# Altium project Microcontroller_redo.PrjPcb
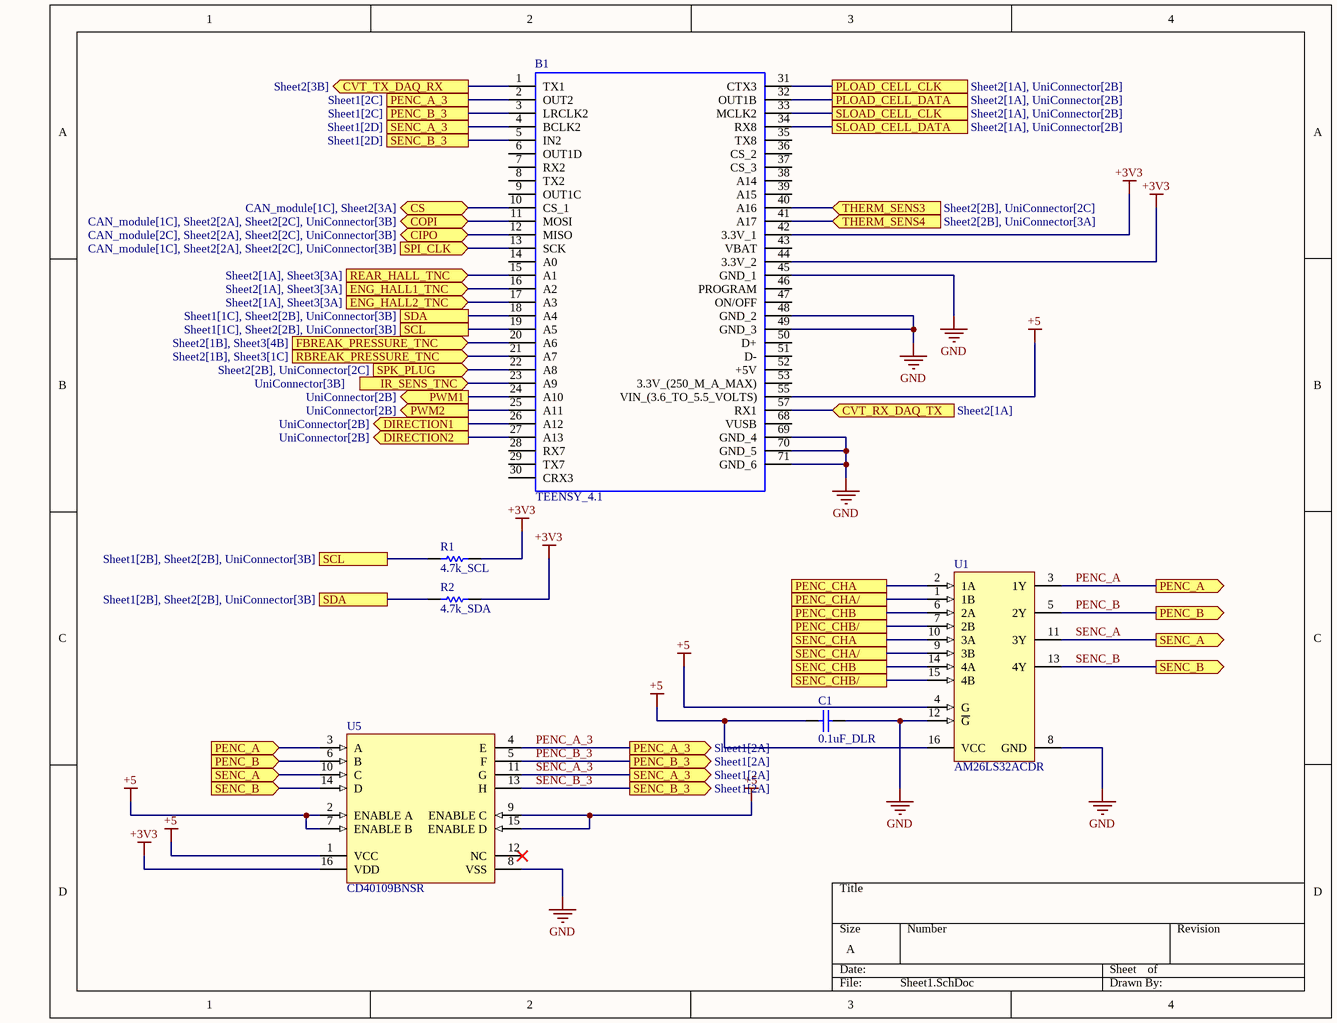
[diagram p0: Sheet1.SchDoc]
5 sheets, 32 parts. Net scope: flat (ports and power ports of the same name join across sheets).
Board file: Microcontroller_Redo.PcbDoc
Sheets:
  Sheet1.SchDoc
  Sheet2.SchDoc
  Sheet3.SchDoc
  UniConnector.SchDoc
  CAN_module.SchDoc

## Sheet Sheet1.SchDoc
size A; SheetNumber: 1; SheetTotal: 5

### Parts
B1  TEENSY_4.1  [TEENSY41]
C1  0.1uF_DLR  [CAPC2013X94X50LL20T25]
R1  4.7k_SCL  [RESC2013X60X40LL20T25]
R2  4.7k_SDA  [RESC2013X60X40LL20T25]
U1  AM26LS32ACDR  [D0016A_M]
U5  CD40109BNSR  [NS0016A_N]

### Ports
CIPO (bidir, see CAN_module[2C], Sheet2[2A], Sheet2[2C], UniConnector[3B]), COPI (bidir, see CAN_module[1C], Sheet2[2A], Sheet2[2C], UniConnector[3B]), CS (bidir, see CAN_module[1C], Sheet2[3A]), CVT_RX_DAQ_TX (in, see Sheet2[1A]), CVT_TX_DAQ_RX (out, see Sheet2[3B]), DIRECTION1 (out, see UniConnector[2B]), DIRECTION2 (out, see UniConnector[2B]), ENG_HALL1_TNC (in, see Sheet2[1A], Sheet3[3A]), ENG_HALL2_TNC (in, see Sheet2[1A], Sheet3[3A]), FBREAK_PRESSURE_TNC (in, see Sheet2[1B], Sheet3[4B]), IR_SENS_TNC (in, see UniConnector[3B]), PENC_A (in, see Sheet1[4C]), PENC_A (out, see Sheet1[1C]), PENC_A_3 (out, see Sheet1[2A]), PENC_A_3 (see Sheet1[2C]), PENC_B (in, see Sheet1[4C]), PENC_B (out, see Sheet1[1C]), PENC_B_3 (out, see Sheet1[2A]), PENC_B_3 (see Sheet1[2C]), PENC_CHA (see UniConnector[2A]), PENC_CHA/ (see UniConnector[2A]), PENC_CHB (see UniConnector[2A]), PENC_CHB/ (see UniConnector[2B]), PLOAD_CELL_CLK (see Sheet2[1A], UniConnector[2B]), PLOAD_CELL_DATA (see Sheet2[1A], UniConnector[2B]), PWM1 (out, see UniConnector[2B]), PWM2 (out, see UniConnector[2B]), RBREAK_PRESSURE_TNC (in, see Sheet2[1B], Sheet3[1C]), REAR_HALL_TNC (in, see Sheet2[1A], Sheet3[3A]), SCL (see Sheet1[1C], Sheet2[2B], UniConnector[3B]), SCL (see Sheet1[2B], Sheet2[2B], UniConnector[3B]), SDA (see Sheet1[1C], Sheet2[2B], UniConnector[3B]), SDA (see Sheet1[2B], Sheet2[2B], UniConnector[3B]), SENC_A (in, see Sheet1[4C]), SENC_A (out, see Sheet1[1D]), SENC_A_3 (out, see Sheet1[2A]), SENC_A_3 (see Sheet1[2D]), SENC_B (in, see Sheet1[4C]), SENC_B (out, see Sheet1[1D]), SENC_B_3 (out, see Sheet1[2A]), SENC_B_3 (see Sheet1[2D]), SENC_CHA (see UniConnector[2B]), SENC_CHA/ (see UniConnector[2B]), SENC_CHB (see UniConnector[2B]), SENC_CHB/ (see UniConnector[2B]), SLOAD_CELL_CLK (see Sheet2[1A], UniConnector[2B]), SLOAD_CELL_DATA (see Sheet2[1A], UniConnector[2B]), SPI_CLK (in, see CAN_module[1C], Sheet2[2A], Sheet2[2C], UniConnector[3B]), SPK_PLUG (in, see Sheet2[2B], UniConnector[2C]), THERM_SENS3 (in, see Sheet2[2B], UniConnector[2C]), THERM_SENS4 (in, see Sheet2[2B], UniConnector[3A])

### Nets
+3V3: B1.42(3.3V_1) B1.44(3.3V_2) R1.2 R2.2 U5.16(VDD)
+5: B1.55(VIN_(3.6_TO_5.5_VOLTS)) C1.1 U1.4(G) U1.16(VCC) U5.1(VCC) U5.2(ENABLE_A) U5.7(ENABLE_B) U5.9(ENABLE_C) U5.15(ENABLE_D)
GND: B1.45(GND_1) B1.48(GND_2) B1.49(GND_3) B1.69(GND_4) B1.70(GND_5) B1.71(GND_6) C1.2 U1.8(GND) U1.12(~{G}) U5.8(VSS)
ENG_HALL1_TNC: B1.16(A2) ; port ENG_HALL1_TNC
ENG_HALL2_TNC: B1.17(A3) ; port ENG_HALL2_TNC
PENC_A: U1.3(1Y) U5.3(A) ; port PENC_A
PENC_A_3: B1.2(OUT2) U5.4(E) ; port PENC_A_3
PENC_B: U1.5(2Y) U5.6(B) ; port PENC_B
PENC_B_3: B1.3(LRCLK2) U5.5(F) ; port PENC_B_3
REAR_HALL_TNC: B1.15(A1) ; port REAR_HALL_TNC
SENC_A: U1.11(3Y) U5.10(C) ; port SENC_A
SENC_A_3: B1.4(BCLK2) U5.11(G) ; port SENC_A_3
SENC_B: U1.13(4Y) U5.14(D) ; port SENC_B
SENC_B_3: B1.5(IN2) U5.13(H) ; port SENC_B_3
NetB1_1: B1.1(TX1) ; port CVT_TX_DAQ_RX
NetB1_10: B1.10(CS_1) ; port CS
NetB1_11: B1.11(MOSI) ; port COPI
NetB1_12: B1.12(MISO) ; port CIPO
NetB1_13: B1.13(SCK) ; port SPI_CLK
NetB1_18: B1.18(A4) R2.1 ; port SDA
NetB1_19: B1.19(A5) R1.1 ; port SCL
NetB1_20: B1.20(A6) ; port FBREAK_PRESSURE_TNC
NetB1_21: B1.21(A7) ; port RBREAK_PRESSURE_TNC
NetB1_22: B1.22(A8) ; port SPK_PLUG
NetB1_23: B1.23(A9) ; port IR_SENS_TNC
NetB1_24: B1.24(A10) ; port PWM1
NetB1_25: B1.25(A11) ; port PWM2
NetB1_26: B1.26(A12) ; port DIRECTION1
NetB1_27: B1.27(A13) ; port DIRECTION2
NetB1_31: B1.31(CTX3) ; port PLOAD_CELL_CLK
NetB1_32: B1.32(OUT1B) ; port PLOAD_CELL_DATA
NetB1_33: B1.33(MCLK2) ; port SLOAD_CELL_CLK
NetB1_34: B1.34(RX8) ; port SLOAD_CELL_DATA
NetB1_40: B1.40(A16) ; port THERM_SENS3
NetB1_41: B1.41(A17) ; port THERM_SENS4
NetB1_57: B1.57(RX1) ; port CVT_RX_DAQ_TX
NetJ1_A1: U1.2(1A) ; port PENC_CHA
NetJ1_A2: U1.1(1B) ; port PENC_CHA/
NetJ1_A3: U1.6(2A) ; port PENC_CHB
NetJ1_A4: U1.7(2B) ; port PENC_CHB/
NetJ1_A5: U1.10(3A) ; port SENC_CHA
NetJ1_A6: U1.9(3B) ; port SENC_CHA/
NetJ1_A7: U1.14(4A) ; port SENC_CHB
NetJ1_A8: U1.15(4B) ; port SENC_CHB/

Not connected (* = marked no-connect by the designer): B1 6(OUT1D) 7(RX2) 8(TX2) 9(OUT1C) 14(A0) 28(RX7) 29(TX7) 30(CRX3) 35(TX8) 36(CS_2) 37(CS_3) 38(A14) 39(A15) 43(VBAT) 46(PROGRAM) 47(ON/OFF) 50(D+) 51(D-) 52(+5V) 53(3.3V_(250_M_A_MAX)) 68(VUSB); U5 12(NC)*

### Library data of the parts
B1 = TEENSY_4.1: Teensy 4.1 Development Board; Manufacturer_Name: PJRC; Manufacturer_Part_Number: TEENSY 4.1; Mouser Part Number: *; Mouser Price/Stock: *; Arrow Part Number: *; Arrow Price/Stock: *; Mouser Testing Part Number: *; Mouser Testing Price/Stock: *; Datasheet Link: https://www.pjrc.com/store/teensy41.html
C1 = CMP-2007-04345-1: Manufacturer: AVX Interconnect / Elco; Part Number: 08055A6R2CAT2A
R1 R2 = CMP-2001-00877-1: Manufacturer: Panasonic; Part Number: ERA6AEB7870V
U1 = CMP-0310-00258-2: Quadruple Differential Line Receiver, 0 TX / 4 RX, 0 to 70 degC, 16-Pin SOIC (D), Green (RoHS & no Sb/Br); Manufacturer: Texas Instruments; Rating: Catalog; ICC(Max)(mA): 70; SubFamily: RS-422; Receivers Per Package: 4; ComponentLink1Description: Datasheet; # of TX/RX: 0 TX / 4 RX; Mounting Technology: Surface Mount; Code_JEDEC: MS-012AC; DatasheetVersion: SLLS115E; ComponentLink2Description: Package Specification; Eco-Plan: Green (RoHS & no Sb/Br); PackageDescription: 16-Pin Plastic Small Outline Integrated Circuit, 9.9 x 3.9 mm, Pitch 1.27 mm Pitch; ComponentLink2URL: http://www.ti.com/litv/pdf/mpds178g; PartNumber: AM26LS32ACDR; PackageReference: D0016A; PackageVersion: revM, Jun-2011; ComponentLink1URL: http://www.ti.com/general/docs/lit/getliterature.tsp?genericPartNumber=AM26LS32AC&fileType=pdf
U5 = CMP-1527-00005-2: CMOS Quad Low-to-High Voltage Level Shifter, 3 to 18 V, -55 to 125 degC, 16-Pin SO (NS16), RoHS, Tape and Reel; Manufacturer: Texas Instruments; Number of Channels: 4; VSS: 3 to 18 V; Propagation Delay: 240 ns Max.; ComponentLink2Description: Datasheet; PackageDescription: 16-Pin Plastic Small Outline Package, Body 10.2 x 5.3 mm, Pitch 1.27 mm; Mounting Technology: Surface Mount; Number of Outputs: 4; ComponentLink3URL: http://www.ti.com/lit/ml/msop002a/msop002a.pdf; Packing: Tape and Reel; RoHS: TRUE; Temperature Range: -55 to 125 degC; PartNumber: CD40109BNSR; PackageVersion: 4040062/C; ComponentLink3Description: Package Specification; DatasheetVersion: SCHS099B; ComponentLink2URL: http://www.ti.com/lit/ds/symlink/cd40109b.pdf; Package Reference: NS0016A; Number of Bits: 4; ComponentLink1Description: Manufacturer URL; ComponentLink1URL: www.ti.com

## Sheet Sheet2.SchDoc
size A; SheetNumber: 2; SheetTotal: 5
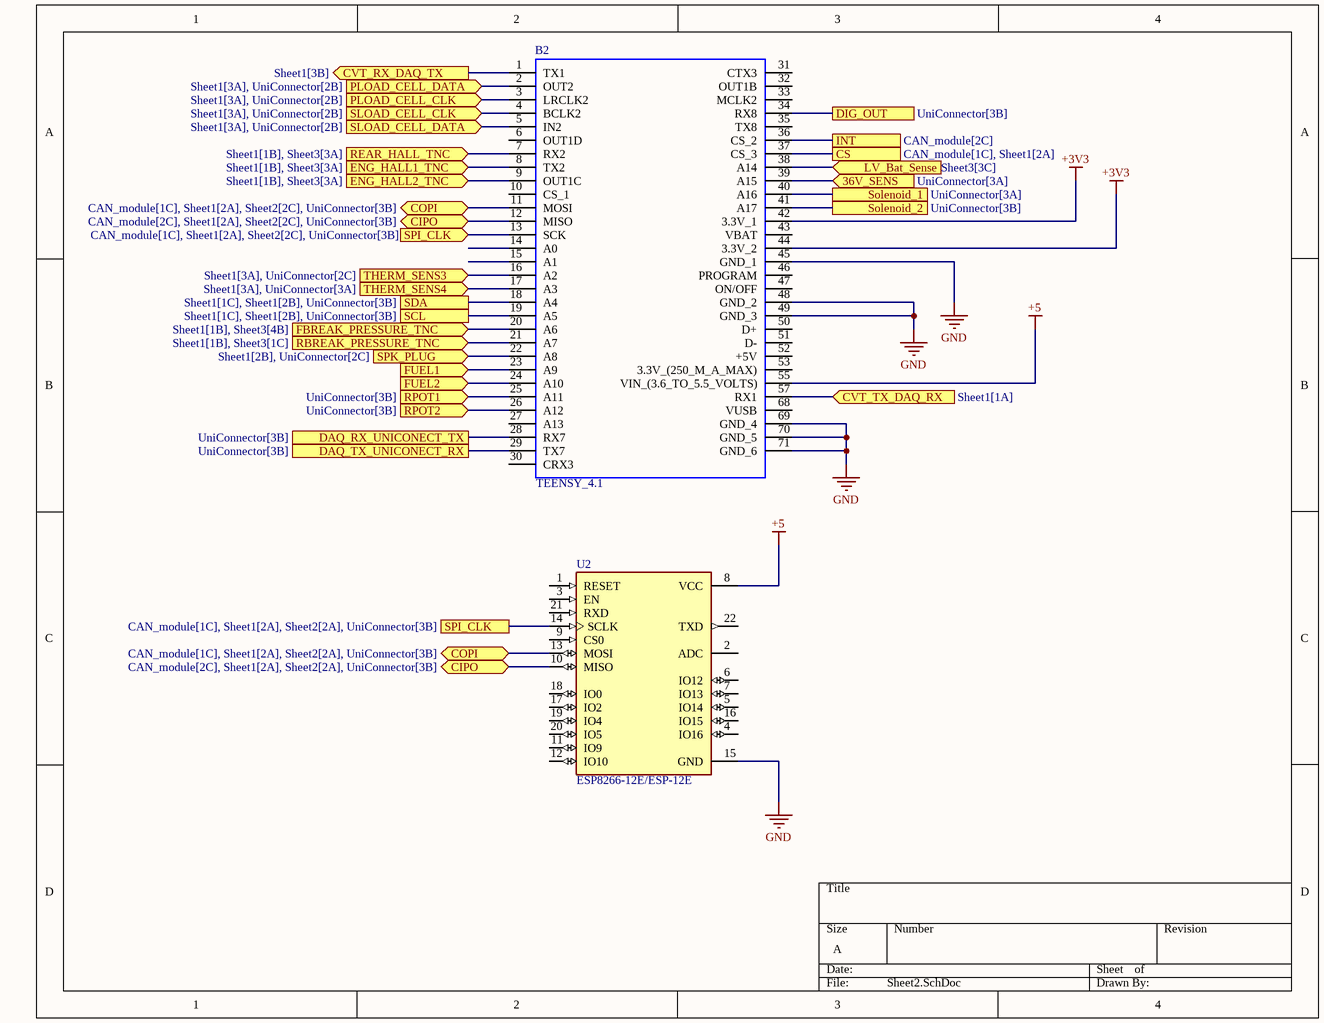
[diagram p1: Sheet2.SchDoc]

### Parts
B2  TEENSY_4.1  [TEENSY41]
U2  ESP8266-12E/ESP-12E  [XCVR_ESP8266-12E/ESP-12E]

### Ports
36V_SENS (in, see UniConnector[3A]), CIPO (bidir, see CAN_module[2C], Sheet1[2A], Sheet2[2A], UniConnector[3B]), CIPO (bidir, see CAN_module[2C], Sheet1[2A], Sheet2[2C], UniConnector[3B]), COPI (bidir, see CAN_module[1C], Sheet1[2A], Sheet2[2A], UniConnector[3B]), COPI (bidir, see CAN_module[1C], Sheet1[2A], Sheet2[2C], UniConnector[3B]), CS (see CAN_module[1C], Sheet1[2A]), CVT_RX_DAQ_TX (out, see Sheet1[3B]), CVT_TX_DAQ_RX (in, see Sheet1[1A]), DAQ_RX_UNICONECT_TX (see UniConnector[3B]), DAQ_TX_UNICONECT_RX (see UniConnector[3B]), DIG_OUT (see UniConnector[3B]), ENG_HALL1_TNC (in, see Sheet1[1B], Sheet3[3A]), ENG_HALL2_TNC (in, see Sheet1[1B], Sheet3[3A]), FBREAK_PRESSURE_TNC (in, see Sheet1[1B], Sheet3[4B]), FUEL1 (in), FUEL2 (in), INT (see CAN_module[2C]), LV_Bat_Sense (in, see Sheet3[3C]), PLOAD_CELL_CLK (in, see Sheet1[3A], UniConnector[2B]), PLOAD_CELL_DATA (in, see Sheet1[3A], UniConnector[2B]), RBREAK_PRESSURE_TNC (in, see Sheet1[1B], Sheet3[1C]), REAR_HALL_TNC (in, see Sheet1[1B], Sheet3[3A]), RPOT1 (in, see UniConnector[3B]), RPOT2 (in, see UniConnector[3B]), SCL (see Sheet1[1C], Sheet1[2B], UniConnector[3B]), SDA (see Sheet1[1C], Sheet1[2B], UniConnector[3B]), SLOAD_CELL_CLK (in, see Sheet1[3A], UniConnector[2B]), SLOAD_CELL_DATA (in, see Sheet1[3A], UniConnector[2B]), Solenoid_1 (see UniConnector[3A]), Solenoid_2 (see UniConnector[3B]), SPI_CLK (in, see CAN_module[1C], Sheet1[2A], Sheet2[2C], UniConnector[3B]), SPI_CLK (see CAN_module[1C], Sheet1[2A], Sheet2[2A], UniConnector[3B]), SPK_PLUG (in, see Sheet1[2B], UniConnector[2C]), THERM_SENS3 (in, see Sheet1[3A], UniConnector[2C]), THERM_SENS4 (in, see Sheet1[3A], UniConnector[3A])

### Nets
+3V3: B2.42(3.3V_1) B2.44(3.3V_2)
+5: B2.55(VIN_(3.6_TO_5.5_VOLTS)) U2.8(VCC)
GND: B2.45(GND_1) B2.48(GND_2) B2.49(GND_3) B2.69(GND_4) B2.70(GND_5) B2.71(GND_6) U2.15(GND)
ENG_HALL1_TNC: B2.8(TX2) ; port ENG_HALL1_TNC
ENG_HALL2_TNC: B2.9(OUT1C) ; port ENG_HALL2_TNC
LV_Bat_Sense: B2.38(A14) ; port LV_Bat_Sense
REAR_HALL_TNC: B2.7(RX2) ; port REAR_HALL_TNC
NetB1_1: B2.57(RX1) ; port CVT_TX_DAQ_RX
NetB1_10: B2.37(CS_3) ; port CS
NetB1_11: B2.11(MOSI) U2.13(MOSI) ; port COPI
NetB1_12: B2.12(MISO) U2.10(MISO) ; port CIPO
NetB1_13: B2.13(SCK) U2.14(SCLK) ; port SPI_CLK
NetB1_18: B2.18(A4) ; port SDA
NetB1_19: B2.19(A5) ; port SCL
NetB1_20: B2.20(A6) ; port FBREAK_PRESSURE_TNC
NetB1_21: B2.21(A7) ; port RBREAK_PRESSURE_TNC
NetB1_22: B2.22(A8) ; port SPK_PLUG
NetB1_31: B2.3(LRCLK2) ; port PLOAD_CELL_CLK
NetB1_32: B2.2(OUT2) ; port PLOAD_CELL_DATA
NetB1_33: B2.4(BCLK2) ; port SLOAD_CELL_CLK
NetB1_34: B2.5(IN2) ; port SLOAD_CELL_DATA
NetB1_40: B2.16(A2) ; port THERM_SENS3
NetB1_41: B2.17(A3) ; port THERM_SENS4
NetB1_57: B2.1(TX1) ; port CVT_RX_DAQ_TX
NetB2_23: B2.23(A9) ; port FUEL1
NetB2_24: B2.24(A10) ; port FUEL2
NetB2_25: B2.25(A11) ; port RPOT1
NetB2_26: B2.26(A12) ; port RPOT2
NetB2_28: B2.28(RX7) ; port DAQ_RX_UNICONECT_TX
NetB2_29: B2.29(TX7) ; port DAQ_TX_UNICONECT_RX
NetB2_34: B2.34(RX8) ; port DIG_OUT
NetB2_36: B2.36(CS_2) ; port INT
NetB2_39: B2.39(A15) ; port 36V_SENS
NetB2_40: B2.40(A16) ; port Solenoid_1
NetB2_41: B2.41(A17) ; port Solenoid_2

Not connected (* = marked no-connect by the designer): B2 6(OUT1D) 10(CS_1) 14(A0) 15(A1) 27(A13) 30(CRX3) 31(CTX3) 32(OUT1B) 33(MCLK2) 35(TX8) 43(VBAT) 46(PROGRAM) 47(ON/OFF) 50(D+) 51(D-) 52(+5V) 53(3.3V_(250_M_A_MAX)) 68(VUSB); U2 1(RESET) 2(ADC) 3(EN) 4(IO16) 5(IO14) 6(IO12) 7(IO13) 9(CS0) 11(IO9) 12(IO10) 16(IO15) 17(IO2) 18(IO0) 19(IO4) 20(IO5) 21(RXD) 22(TXD)

### Library data of the parts
B2 = TEENSY_4.1: as B1 on sheet Sheet1; Manufacturer_Part_Number: TEENSY 4.1; Mouser Part Number: *; Mouser Price/Stock: *; Arrow Part Number: *; Arrow Price/Stock: *; Mouser Testing Part Number: *; Mouser Testing Price/Stock: *; Datasheet Link: https://www.pjrc.com/store/teensy41.html
U2 = ESP8266-12E/ESP-12E: This WiFi module has a 32-bit MCU micro and clock speeds supporting 80 MHz or 160 MHz. Supports the RTOS and integrated Wi-Fi MAC/BB/RF/PA/LNA, and has an on-board antenna.; MF: AI-Thinker; Value: *; SnapEDA_Link: https://www.snapeda.com/parts/ESP8266-12E/ESP-12E/AI-Thinker/view-part/?ref=snap; Availability: Not in stock; Price: None; Package: None; Check_prices: https://www.snapeda.com/parts/ESP8266-12E/ESP-12E/AI-Thinker/view-part/?ref=eda; MP: ESP8266-12E/ESP-12E

## Sheet Sheet3.SchDoc
size A; SheetNumber: 3; SheetTotal: 5
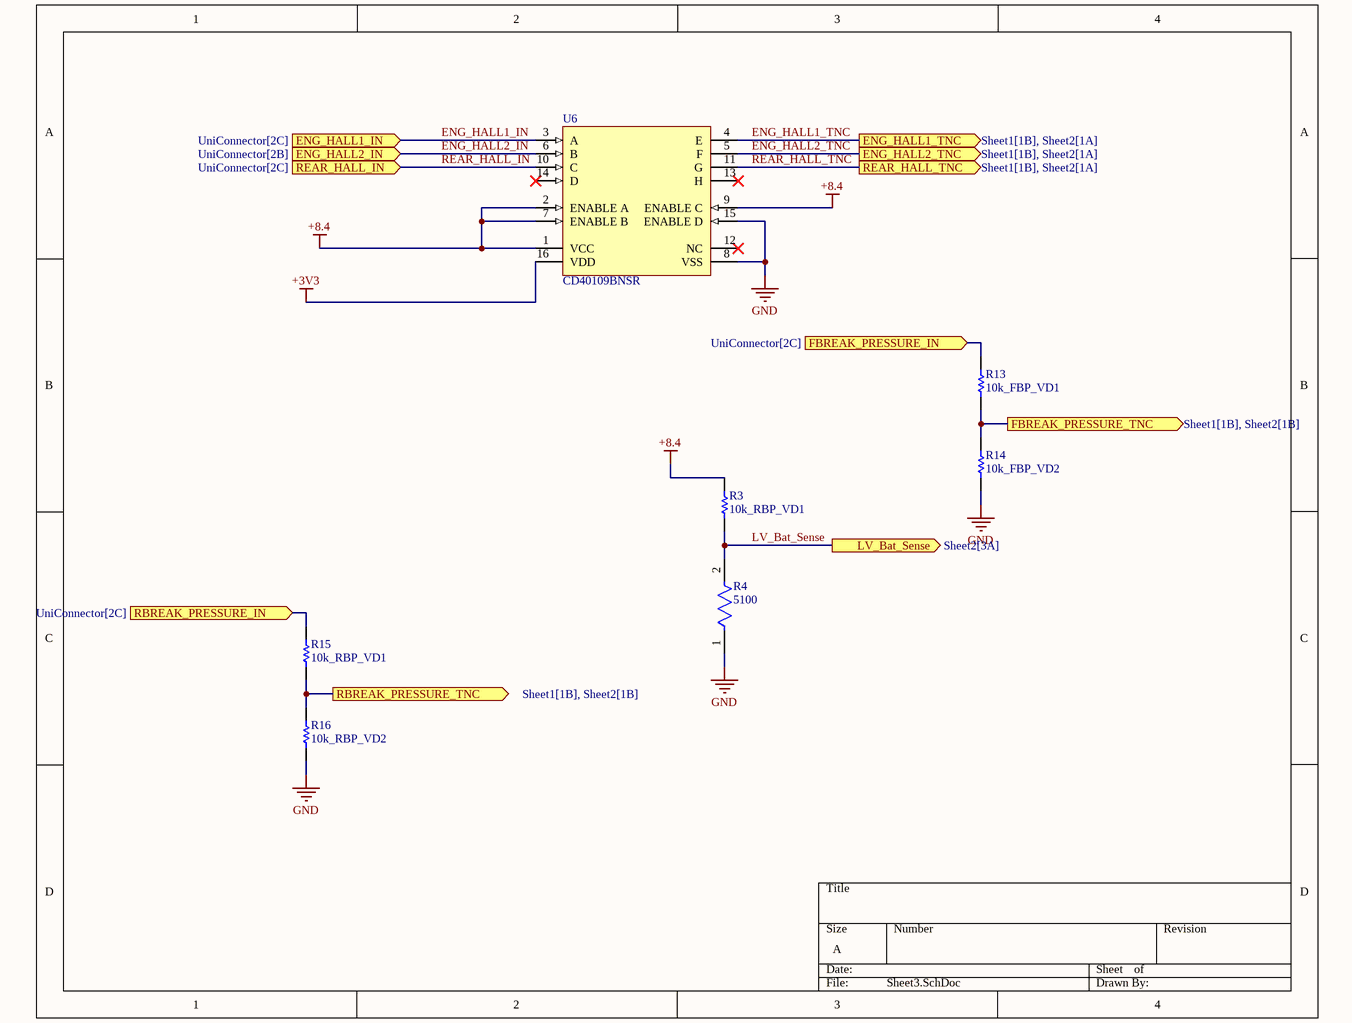
[diagram p2: Sheet3.SchDoc]

### Parts
R3  10k_RBP_VD1  [RESC2013X60X40LL20T25]
R4  5100  [FP-CRCW0805-e3-MFG]
R13  10k_FBP_VD1  [RESC2013X60X40LL20T25]
R14  10k_FBP_VD2  [RESC2013X60X40LL20T25]
R15  10k_RBP_VD1  [RESC2013X60X40LL20T25]
R16  10k_RBP_VD2  [RESC2013X60X40LL20T25]
U6  CD40109BNSR  [NS0016A_N]

### Ports
ENG_HALL1_IN (in, see UniConnector[2C]), ENG_HALL1_TNC (out, see Sheet1[1B], Sheet2[1A]), ENG_HALL2_IN (in, see UniConnector[2B]), ENG_HALL2_TNC (out, see Sheet1[1B], Sheet2[1A]), FBREAK_PRESSURE_IN (in, see UniConnector[2C]), FBREAK_PRESSURE_TNC (out, see Sheet1[1B], Sheet2[1B]), LV_Bat_Sense (out, see Sheet2[3A]), RBREAK_PRESSURE_IN (in, see UniConnector[2C]), RBREAK_PRESSURE_TNC (out, see Sheet1[1B], Sheet2[1B]), REAR_HALL_IN (in, see UniConnector[2C]), REAR_HALL_TNC (out, see Sheet1[1B], Sheet2[1A])

### Nets
+3V3: U6.16(VDD)
+8.4: R3.2 U6.1(VCC) U6.2(ENABLE_A) U6.7(ENABLE_B) U6.9(ENABLE_C)
GND: R4.1 R14.1 R16.1 U6.8(VSS) U6.15(ENABLE_D)
ENG_HALL1_IN: U6.3(A) ; port ENG_HALL1_IN
ENG_HALL1_TNC: U6.4(E) ; port ENG_HALL1_TNC
ENG_HALL2_IN: U6.6(B) ; port ENG_HALL2_IN
ENG_HALL2_TNC: U6.5(F) ; port ENG_HALL2_TNC
LV_Bat_Sense: R3.1 R4.2 ; port LV_Bat_Sense
REAR_HALL_IN: U6.10(C) ; port REAR_HALL_IN
REAR_HALL_TNC: U6.11(G) ; port REAR_HALL_TNC
NetB1_20: R13.1 R14.2 ; port FBREAK_PRESSURE_TNC
NetB1_21: R15.1 R16.2 ; port RBREAK_PRESSURE_TNC
NetJ1_B11: R13.2 ; port FBREAK_PRESSURE_IN
NetJ1_B12: R15.2 ; port RBREAK_PRESSURE_IN

Not connected (* = marked no-connect by the designer): U6 12(NC)* 13(H)* 14(D)*

### Library data of the parts
R3 R13-R16 = CMP-2001-00877-1: as R1 on sheet Sheet1
R4 = CMP-2001-04024-2: RES Thick Film, 5.1kΩ, 1%, 0.125W, 100ppm/°C, 0805 CRCW08055K10FKEA; Power Rating: 125mW; Voltage Rating (DC): 150V; Resistance: 5.1kR; Packaging: Tape and Reel; Case Code (Metric): 2012; Contact Plating: Tin; Case Code (Imperial): 0805; Depth: 1.25mm; Tolerance: 1%; Width: 0.049inch; Temperature Coefficient: 100ppm/°C; Max Power Dissipation: 125mW; Military Standard: Not; Lead Free: Lead Free; Mount: Surface Mount; Min Operating Temperature: -55°C; Package Quantity: 10; Weight: 0.000194oz; Height: 0.45mm; Number of Terminations: 2; Max Operating Temperature: 155°C; Termination: SMD/SMT; Case/Package: 0805; Composition: Thick Film; Voltage Rating: 150V; Length: 2mm; Features: Automotive AEC-Q200; Radiation Hardening: No
U6 = CMP-1527-00005-2: as U5 on sheet Sheet1; ComponentLink2Description: Datasheet; PackageDescription: 16-Pin Plastic Small Outline Package, Body 10.2 x 5.3 mm, Pitch 1.27 mm; Mounting Technology: Surface Mount; Number of Outputs: 4; ComponentLink3URL: http://www.ti.com/lit/ml/msop002a/msop002a.pdf; Packing: Tape and Reel; RoHS: TRUE; Temperature Range: -55 to 125 degC; PartNumber: CD40109BNSR; PackageVersion: 4040062/C; ComponentLink3Description: Package Specification; DatasheetVersion: SCHS099B; ComponentLink2URL: http://www.ti.com/lit/ds/symlink/cd40109b.pdf; Package Reference: NS0016A; Number of Bits: 4; ComponentLink1Description: Manufacturer URL; ComponentLink1URL: www.ti.com

## Sheet UniConnector.SchDoc
size A; SheetNumber: 4; SheetTotal: 5
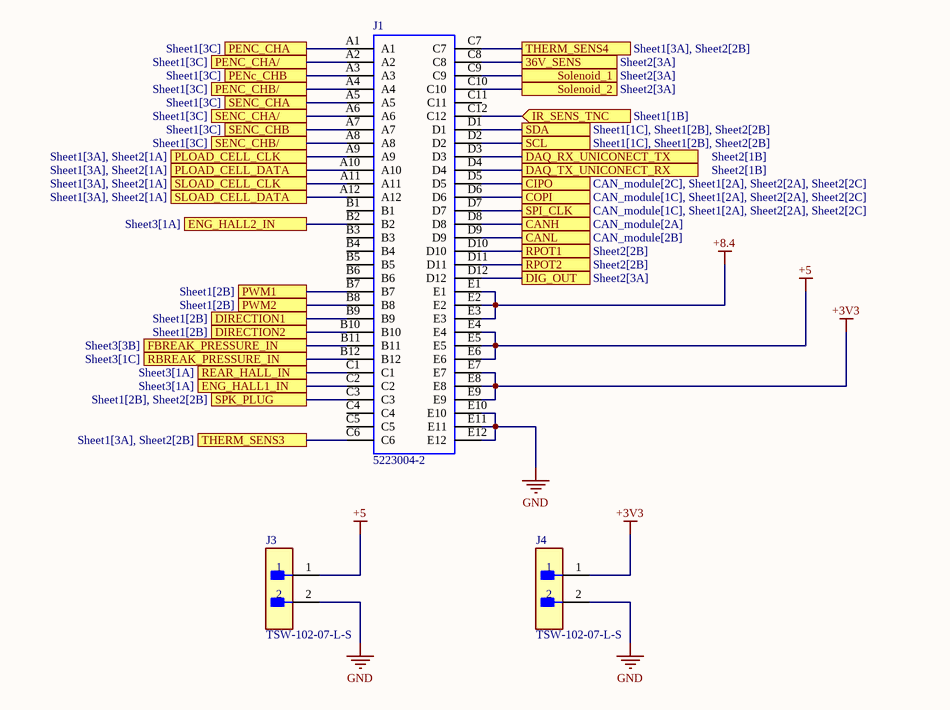
[diagram p3: UniConnector.SchDoc]

### Parts
J1  5223004-2  [52230042]
J3  TSW-102-07-L-S  [FP-TSW-102-07-L-S-MFG]
J4  TSW-102-07-L-S  [FP-TSW-102-07-L-S-MFG]

### Ports
36V_SENS (see Sheet2[3A]), CANH (see CAN_module[2A]), CANL (see CAN_module[2B]), CIPO (see CAN_module[2C], Sheet1[2A], Sheet2[2A], Sheet2[2C]), COPI (see CAN_module[1C], Sheet1[2A], Sheet2[2A], Sheet2[2C]), DAQ_RX_UNICONECT_TX (see Sheet2[1B]), DAQ_TX_UNICONECT_RX (see Sheet2[1B]), DIG_OUT (see Sheet2[3A]), DIRECTION1 (see Sheet1[2B]), DIRECTION2 (see Sheet1[2B]), ENG_HALL1_IN (see Sheet3[1A]), ENG_HALL2_IN (see Sheet3[1A]), FBREAK_PRESSURE_IN (see Sheet3[3B]), IR_SENS_TNC (in, see Sheet1[1B]), PENC_CHA (see Sheet1[3C]), PENC_CHA/ (see Sheet1[3C]), PENc_CHB (see Sheet1[3C]), PENC_CHB/ (see Sheet1[3C]), PLOAD_CELL_CLK (see Sheet1[3A], Sheet2[1A]), PLOAD_CELL_DATA (see Sheet1[3A], Sheet2[1A]), PWM1 (see Sheet1[2B]), PWM2 (see Sheet1[2B]), RBREAK_PRESSURE_IN (see Sheet3[1C]), REAR_HALL_IN (see Sheet3[1A]), RPOT1 (see Sheet2[2B]), RPOT2 (see Sheet2[2B]), SCL (see Sheet1[1C], Sheet1[2B], Sheet2[2B]), SDA (see Sheet1[1C], Sheet1[2B], Sheet2[2B]), SENC_CHA (see Sheet1[3C]), SENC_CHA/ (see Sheet1[3C]), SENC_CHB (see Sheet1[3C]), SENC_CHB/ (see Sheet1[3C]), SLOAD_CELL_CLK (see Sheet1[3A], Sheet2[1A]), SLOAD_CELL_DATA (see Sheet1[3A], Sheet2[1A]), Solenoid_1 (see Sheet2[3A]), Solenoid_2 (see Sheet2[3A]), SPI_CLK (see CAN_module[1C], Sheet1[2A], Sheet2[2A], Sheet2[2C]), SPK_PLUG (see Sheet1[2B], Sheet2[2B]), THERM_SENS3 (see Sheet1[3A], Sheet2[2B]), THERM_SENS4 (see Sheet1[3A], Sheet2[2B])

### Nets
+3V3: J1.E7 J1.E8 J1.E9 J4.1
+5: J1.E4 J1.E5 J1.E6 J3.1
+8.4: J1.E1 J1.E2 J1.E3
GND: J1.E10 J1.E11 J1.E12 J3.2 J4.2
ENG_HALL1_IN: J1.C2 ; port ENG_HALL1_IN
ENG_HALL2_IN: J1.B2 ; port ENG_HALL2_IN
REAR_HALL_IN: J1.C1 ; port REAR_HALL_IN
NetB1_11: J1.D6 ; port COPI
NetB1_12: J1.D5 ; port CIPO
NetB1_13: J1.D7 ; port SPI_CLK
NetB1_18: J1.D1 ; port SDA
NetB1_19: J1.D2 ; port SCL
NetB1_22: J1.C3 ; port SPK_PLUG
NetB1_23: J1.C12 ; port IR_SENS_TNC
NetB1_24: J1.B7 ; port PWM1
NetB1_25: J1.B8 ; port PWM2
NetB1_26: J1.B9 ; port DIRECTION1
NetB1_27: J1.B10 ; port DIRECTION2
NetB1_31: J1.A9 ; port PLOAD_CELL_CLK
NetB1_32: J1.A10 ; port PLOAD_CELL_DATA
NetB1_33: J1.A11 ; port SLOAD_CELL_CLK
NetB1_34: J1.A12 ; port SLOAD_CELL_DATA
NetB1_40: J1.C6 ; port THERM_SENS3
NetB1_41: J1.C7 ; port THERM_SENS4
NetB2_25: J1.D10 ; port RPOT1
NetB2_26: J1.D11 ; port RPOT2
NetB2_28: J1.D3 ; port DAQ_RX_UNICONECT_TX
NetB2_29: J1.D4 ; port DAQ_TX_UNICONECT_RX
NetB2_34: J1.D12 ; port DIG_OUT
NetB2_39: J1.C8 ; port 36V_SENS
NetB2_40: J1.C9 ; port Solenoid_1
NetB2_41: J1.C10 ; port Solenoid_2
NetJ1_A1: J1.A1 ; port PENC_CHA
NetJ1_A2: J1.A2 ; port PENC_CHA/
NetJ1_A3: J1.A3 ; port PENc_CHB
NetJ1_A4: J1.A4 ; port PENC_CHB/
NetJ1_A5: J1.A5 ; port SENC_CHA
NetJ1_A6: J1.A6 ; port SENC_CHA/
NetJ1_A7: J1.A7 ; port SENC_CHB
NetJ1_A8: J1.A8 ; port SENC_CHB/
NetJ1_B11: J1.B11 ; port FBREAK_PRESSURE_IN
NetJ1_B12: J1.B12 ; port RBREAK_PRESSURE_IN
NetJ1_D8: J1.D8 ; port CANH
NetJ1_D9: J1.D9 ; port CANL

Not connected (* = marked no-connect by the designer): J1 B1 B3 B4 B5 B6 C4 C5 C11

### Library data of the parts
J1 = 5223004-2: Conn Backplane RCP 60 POS 2mm Solder RA Thru-Hole Tube; Manufacturer_Name: TE Connectivity; Geometry.Height: 14mm; Mouser Part Number: 571-5223004-2; Mouser Price/Stock: https://www.mouser.co.uk/ProductDetail/TE-Connectivity/5223004-2?qs=oNRo%252BTjlpTO6tP0xSX%252BI3w%3D%3D; Manufacturer_Part_Number: 5223004-2; Datasheet Link: https://www.te.com/commerce/DocumentDelivery/DDEController?Action=srchrtrv&DocNm=5223004&DocType=Customer+Drawing&DocLang=English
J3 J4 = CMP-02766-001428-1: CONN HEADER VERT 2POS 2.54MM; Voltage Rating: 550V; Current Rating: 7.6A; Gender: Male; Number of Contacts: 2; Connector Type: Male Pin; Radiation Hardening: No; Orientation: Straight; Contact Plating: Gold; Max Operating Temperature: 125°C; Mount: Through Hole; Package Quantity: 1; Number of Rows: 1; Housing Material: Polyester; RoHS Compliant: Yes; Length: 5.08mm; Max Voltage Rating (AC): 550V; Pitch: 2.54mm; Packaging: Bulk; Depth: 2.54mm; Termination: Solder; Min Operating Temperature: -55°C; Housing Color: Black; Lead Free: Lead Free; Color: Black; Number of Positions: 2; Width: 2.54mm; Max Current Rating: 7.6A; REACH SVHC: No SVHC; Contact Material: Bronze; Contact Mating Length: 0.23inch; Series: TSW; Contact Type: Male Pin

## Sheet CAN_module.SchDoc
size A; SheetNumber: 5; SheetTotal: 5
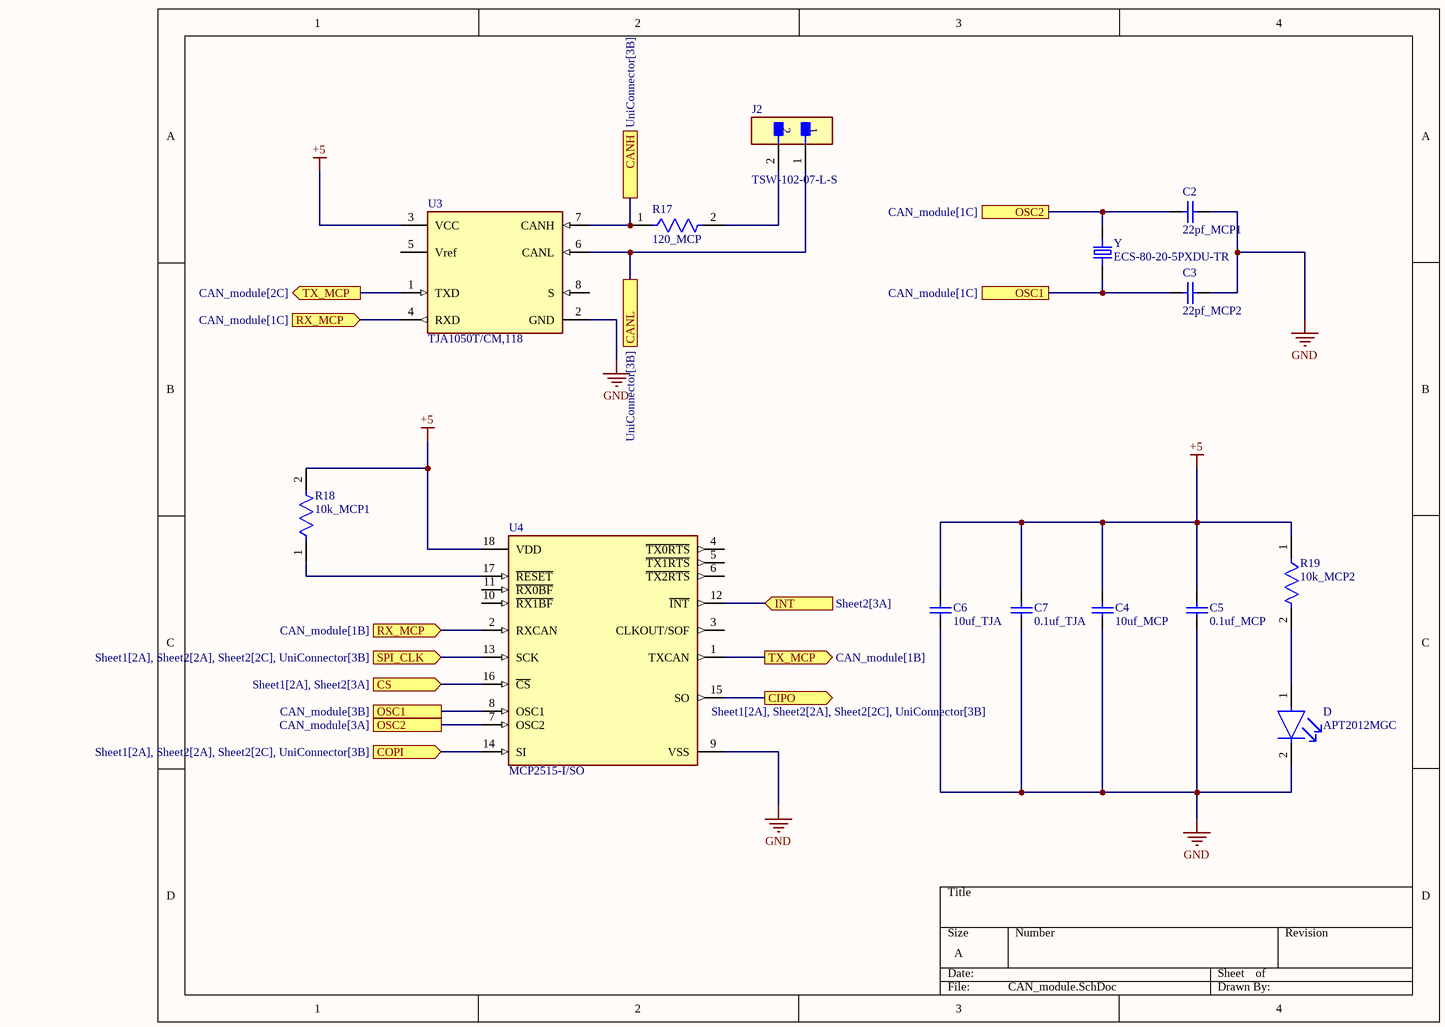
[diagram p4: CAN_module.SchDoc]

### Parts
C2  22pf_MCP1  [CAPC2013X145X50NL20T20]
C3  22pf_MCP2  [CAPC2013X145X50NL20T20]
C4  10uf_MCP  [CAPC2013X145X50NL20T20]
C5  0.1uf_MCP  [CAPC2013X145X50NL20T20]
C6  10uf_TJA  [CAPC2013X145X50NL20T20]
C7  0.1uf_TJA  [CAPC2013X145X50NL20T20]
D  APT2012MGC  [FP-APT2012MGC-MFG]
J2  TSW-102-07-L-S  [FP-TSW-102-07-L-S-MFG]
R17  120_MCP  [FP-CRCW0805-e3-IPC_C]
R18  10k_MCP1  [FP-CRCW0805-e3-IPC_C]
R19  10k_MCP2  [FP-CRCW0805-e3-IPC_C]
U3  TJA1050T/CM,118  [FP-SOT96-1-IPC_A]
U4  MCP2515-I/SO  [FP-C04-051-MFG]
Y  ECS-80-20-5PXDU-TR  [XTAL_ECS-80-20-5PXDU-TR]

### Ports
CANH (see UniConnector[3B]), CANL (see UniConnector[3B]), CIPO (out, see Sheet1[2A], Sheet2[2A], Sheet2[2C], UniConnector[3B]), COPI (in, see Sheet1[2A], Sheet2[2A], Sheet2[2C], UniConnector[3B]), CS (in, see Sheet1[2A], Sheet2[3A]), INT (in, see Sheet2[3A]), OSC1 (see CAN_module[1C]), OSC1 (see CAN_module[3B]), OSC2 (see CAN_module[1C]), OSC2 (see CAN_module[3A]), RX_MCP (in, see CAN_module[1B]), RX_MCP (in, see CAN_module[1C]), SPI_CLK (in, see Sheet1[2A], Sheet2[2A], Sheet2[2C], UniConnector[3B]), TX_MCP (out, see CAN_module[1B]), TX_MCP (out, see CAN_module[2C])

### Nets
+5: C4.2 C5.2 C6.2 C7.2 R18.2 R19.1 U3.3(VCC) U4.18(VDD)
GND: C2.2 C3.2 C4.1 C5.1 C6.1 C7.1 D.2(C) U3.2(GND) U4.9(VSS)
NetB1_10: U4.16(~{CS}) ; port CS
NetB1_11: U4.14(SI) ; port COPI
NetB1_12: U4.15(SO) ; port CIPO
NetB1_13: U4.13(SCK) ; port SPI_CLK
NetB2_36: U4.12(~{INT}) ; port INT
NetC2_1: C2.1 U4.7(OSC2) Y.2 ; port OSC2
NetC3_1: C3.1 U4.8(OSC1) Y.1 ; port OSC1
NetD_1: D.1(A) R19.2
NetJ1_D8: R17.1 U3.7(CANH) ; port CANH
NetJ1_D9: J2.1 U3.6(CANL) ; port CANL
NetJ2_2: J2.2 R17.2
NetR18_1: R18.1 U4.17(~{RESET})
NetU3_1: U3.1(TXD) U4.1(TXCAN) ; port TX_MCP
NetU3_4: U3.4(RXD) U4.2(RXCAN) ; port RX_MCP

Not connected (* = marked no-connect by the designer): U3 5(Vref) 8(S); U4 3(CLKOUT/SOF) 4(~{TX0RTS}) 5(~{TX1RTS}) 6(~{TX2RTS}) 10(~{RX1BF}) 11(~{RX0BF})

### Library data of the parts
C2-C7 = CMP-1036-01227-2: Manufacturer: Vitramon; Part Number: VJ0805A220GXXCW1BC
D = CMP-44529-000017-1: LED GREEN CLEAR CHIP SMD; Power Rating: 75mW; Lens Color: Colorless; Luminous Intensity: 70mcd; Forward Current: 20mA; Dominant Wavelength: 570nm; Viewing Angle: 120°; Forward Voltage: 2.1V; Package Quantity: 2000; Color: Green; Length: 2mm; Lead Free: Lead Free; Min Operating Temperature: -40°C; Illumination Color: Green; Case/Package: 0805; Width: 1.25mm; Test Current: 20mA; Max Operating Temperature: 85°C; Case Code (Imperial): 0805; Mount: Surface Mount; Lens Style: Clear; Height: 0.75mm; Case Code (Metric): 2012; Packaging: Tape and Reel; Lens Transparency: Clear
J2 = CMP-02766-001428-1: as J3 on sheet UniConnector; Radiation Hardening: No; Orientation: Straight; Contact Plating: Gold; Max Operating Temperature: 125°C; Mount: Through Hole; Package Quantity: 1; Number of Rows: 1; Housing Material: Polyester; RoHS Compliant: Yes; Length: 5.08mm; Max Voltage Rating (AC): 550V; Pitch: 2.54mm; Packaging: Bulk; Depth: 2.54mm; Termination: Solder; Min Operating Temperature: -55°C; Housing Color: Black; Lead Free: Lead Free; Color: Black; Number of Positions: 2; Width: 2.54mm; Max Current Rating: 7.6A; REACH SVHC: No SVHC; Contact Material: Bronze; Contact Mating Length: 0.23inch; Series: TSW; Contact Type: Male Pin
R17-R19 = CMP-02407-009256-1: RES Thick Film, 4.02Ω, 1%, 0.125W, 200ppm/°C, 0805; Resistance: 4.02R; Power Rating: 125mW; Voltage Rating: 150V; Features: Automotive AEC-Q200; Weight: 0.000194oz; Height: 0.02inch; Case Code (Metric): 2012; Composition: Thick Film; Temperature Coefficient: 200ppm/°C; Case/Package: 0805; Min Operating Temperature: -55°C; Width: 0.049inch; Contact Plating: Tin; Packaging: Tape and Reel; Tolerance: 1%; Length: 0.079inch; Lead Free: Lead Free; Case Code (Imperial): 0805; Package Quantity: 5000; Radiation Hardening: No; Max Operating Temperature: 155°C; Number of Terminations: 2; Max Power Dissipation: 125mW; Voltage Rating (DC): 150V
U3 = CMP-2000-04923-2: IC TRANSCEIVER HALF 1/1 8SO; Simplex/Duplex: Half Duplex; Max Supply Current: 10mA; Number of Receive Buffers: 1; Min Supply Voltage: 4.75V; Max Supply Voltage: 5.25V; Interface: CAN; Data Rate: 1Mbps; Receiver Hysteresis: 70mV; Number of Transmit Buffers: 1; Min Operating Temperature: -40°C; Case/Package: SO; REACH SVHC: No SVHC; Max Operating Temperature: 150°C; Number of Pins: 8; Lead Free: Lead Free; Number of Transceivers: 1; Packaging: Tape and Reel; Mount: Surface Mount; Radiation Hardening: No; Nominal Supply Current: 10mA; Package Quantity: 2500; Contact Plating: Gold
U4 = CMP-0186-00133-3: IC CAN CONTROLLER W/SPI 18SOIC; Manufacturer: Microchip; Min Supply Voltage: 2.7V; Max Supply Voltage: 5.5V; Standoff Height: 0.1mm; Nominal Supply Current: 10mA; Interface: SPI,CAN; Lead Free: Yes; Digikey Description: IC CAN CONTROLLER W/SPI 18SOIC; Category: IC; RoHS: TRUE; Manufacturer Part Number: MCP2515-I/SO; ComponentLink2URL: http://ww1.microchip.com/downloads/en/DeviceDoc/MCP2515-Stand-Alone-CAN-Controller-with-SPI-20001801J.pdf; Mouser Description: CAN Interface IC W/ SPI Interface; Device Class L2: Interface ICs; Package: C04-051; Automotive: No; Function: Controller; Octopart: https://octopart.com/mcp2515-i%2Fso-microchip-430187; Temperature: -40°C to +85°C; Ipc Land Pattern Name: SOIC127P1030X265-18; Ambient Temperature Range Low: -65°C; Height: 2.65mm; Device Class L1: Integrated Circuits (ICs); Ambient Temperature Range High: +125°C; Footprint Url: http://ww1.microchip.com/downloads/en/DeviceDoc/18L_SOIC_Wide_7.50_SO_C04-0051D.pdf; Temperature Range Low: -40°C; Device Class L3: Controllers; Temperature Range High: +85°C; ComponentLink2Description: Datasheet
Y = ECS-80-20-5PXDU-TR: 8MHz Â±30ppm Crystal 20pF 60 Ohms HC-49/US; MF: ECS Inc.; Package: HC49/US ECS International; Availability: Unavailable; Value: *; MP: ECS-80-20-5PXDU-TR; SnapEDA_Link: https://www.snapeda.com/parts/ECS-80-20-5PXDU-TR/ECS%20Inc./view-part/584052/?ref=snap; Price: None

## Nets that join several sheets
+3V3: Sheet1 (5 pins), Sheet2 (B2.42 B2.44), Sheet3 (U6.16), UniConnector (J1.E7 J1.E8 J1.E9 J4.1)
+5: Sheet1 (9 pins), Sheet2 (B2.55 U2.8), UniConnector (J1.E4 J1.E5 J1.E6 J3.1), CAN_module (8 pins)
+8.4: Sheet3 (5 pins), UniConnector (J1.E1 J1.E2 J1.E3)
GND: Sheet1 (10 pins), Sheet2 (7 pins), Sheet3 (5 pins), UniConnector (5 pins), CAN_module (9 pins)
ENG_HALL1_IN: Sheet3 (U6.3), UniConnector (J1.C2)
ENG_HALL1_TNC: Sheet1 (B1.16), Sheet2 (B2.8), Sheet3 (U6.4)
ENG_HALL2_IN: Sheet3 (U6.6), UniConnector (J1.B2)
ENG_HALL2_TNC: Sheet1 (B1.17), Sheet2 (B2.9), Sheet3 (U6.5)
LV_Bat_Sense: Sheet2 (B2.38), Sheet3 (R3.1 R4.2)
NetB1_1: Sheet1 (B1.1), Sheet2 (B2.57)
NetB1_10: Sheet1 (B1.10), Sheet2 (B2.37), CAN_module (U4.16)
NetB1_11: Sheet1 (B1.11), Sheet2 (B2.11 U2.13), UniConnector (J1.D6), CAN_module (U4.14)
NetB1_12: Sheet1 (B1.12), Sheet2 (B2.12 U2.10), UniConnector (J1.D5), CAN_module (U4.15)
NetB1_13: Sheet1 (B1.13), Sheet2 (B2.13 U2.14), UniConnector (J1.D7), CAN_module (U4.13)
NetB1_18: Sheet1 (B1.18 R2.1), Sheet2 (B2.18), UniConnector (J1.D1)
NetB1_19: Sheet1 (B1.19 R1.1), Sheet2 (B2.19), UniConnector (J1.D2)
NetB1_20: Sheet1 (B1.20), Sheet2 (B2.20), Sheet3 (R13.1 R14.2)
NetB1_21: Sheet1 (B1.21), Sheet2 (B2.21), Sheet3 (R15.1 R16.2)
NetB1_22: Sheet1 (B1.22), Sheet2 (B2.22), UniConnector (J1.C3)
NetB1_23: Sheet1 (B1.23), UniConnector (J1.C12)
NetB1_24: Sheet1 (B1.24), UniConnector (J1.B7)
NetB1_25: Sheet1 (B1.25), UniConnector (J1.B8)
NetB1_26: Sheet1 (B1.26), UniConnector (J1.B9)
NetB1_27: Sheet1 (B1.27), UniConnector (J1.B10)
NetB1_31: Sheet1 (B1.31), Sheet2 (B2.3), UniConnector (J1.A9)
NetB1_32: Sheet1 (B1.32), Sheet2 (B2.2), UniConnector (J1.A10)
NetB1_33: Sheet1 (B1.33), Sheet2 (B2.4), UniConnector (J1.A11)
NetB1_34: Sheet1 (B1.34), Sheet2 (B2.5), UniConnector (J1.A12)
NetB1_40: Sheet1 (B1.40), Sheet2 (B2.16), UniConnector (J1.C6)
NetB1_41: Sheet1 (B1.41), Sheet2 (B2.17), UniConnector (J1.C7)
NetB1_57: Sheet1 (B1.57), Sheet2 (B2.1)
NetB2_25: Sheet2 (B2.25), UniConnector (J1.D10)
NetB2_26: Sheet2 (B2.26), UniConnector (J1.D11)
NetB2_28: Sheet2 (B2.28), UniConnector (J1.D3)
NetB2_29: Sheet2 (B2.29), UniConnector (J1.D4)
NetB2_34: Sheet2 (B2.34), UniConnector (J1.D12)
NetB2_36: Sheet2 (B2.36), CAN_module (U4.12)
NetB2_39: Sheet2 (B2.39), UniConnector (J1.C8)
NetB2_40: Sheet2 (B2.40), UniConnector (J1.C9)
NetB2_41: Sheet2 (B2.41), UniConnector (J1.C10)
NetJ1_A1: Sheet1 (U1.2), UniConnector (J1.A1)
NetJ1_A2: Sheet1 (U1.1), UniConnector (J1.A2)
NetJ1_A3: Sheet1 (U1.6), UniConnector (J1.A3)
NetJ1_A4: Sheet1 (U1.7), UniConnector (J1.A4)
NetJ1_A5: Sheet1 (U1.10), UniConnector (J1.A5)
NetJ1_A6: Sheet1 (U1.9), UniConnector (J1.A6)
NetJ1_A7: Sheet1 (U1.14), UniConnector (J1.A7)
NetJ1_A8: Sheet1 (U1.15), UniConnector (J1.A8)
NetJ1_B11: Sheet3 (R13.2), UniConnector (J1.B11)
NetJ1_B12: Sheet3 (R15.2), UniConnector (J1.B12)
NetJ1_D8: UniConnector (J1.D8), CAN_module (R17.1 U3.7)
NetJ1_D9: UniConnector (J1.D9), CAN_module (J2.1 U3.6)
REAR_HALL_IN: Sheet3 (U6.10), UniConnector (J1.C1)
REAR_HALL_TNC: Sheet1 (B1.15), Sheet2 (B2.7), Sheet3 (U6.11)